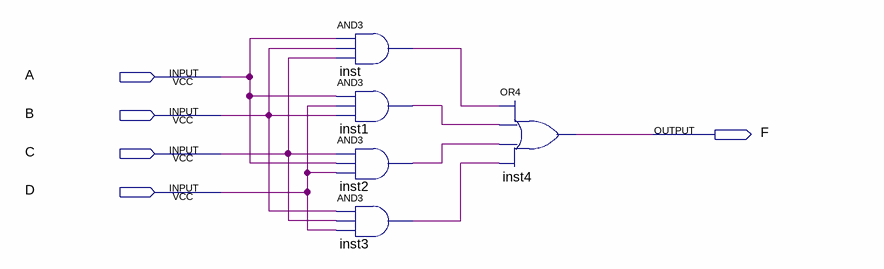
[diagram p0: schematic sheet]
// Quartus schematic wVoter.bdf as structural Verilog: 5 symbols, 5 pins
module wVoter (
  input  A,
  input  B,
  input  C,
  input  D,
  output F
);

  wire inst1_out, inst2_out, inst3_out, inst_out;

  and inst (inst_out, A, B, C);
  and inst1 (inst1_out, A, D, B);
  and inst2 (inst2_out, C, A, D);
  and inst3 (inst3_out, B, C, D);
  or inst4 (F, inst_out, inst1_out, inst2_out, inst3_out);
endmodule
